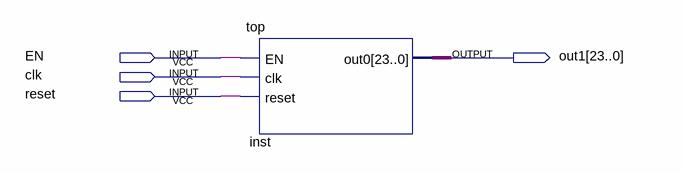
[diagram p0: schematic sheet]
// Quartus schematic top_level.bdf as structural Verilog: 1 symbols, 4 pins
module top_level (
  input  EN,
  input  clk,
  input  reset,
  output [23:0] out1
);

  top inst (.EN(EN), .clk(clk), .reset(reset), .out0(out1));
endmodule
